# EAGLE design M360 (EAGLE 6.6.0)
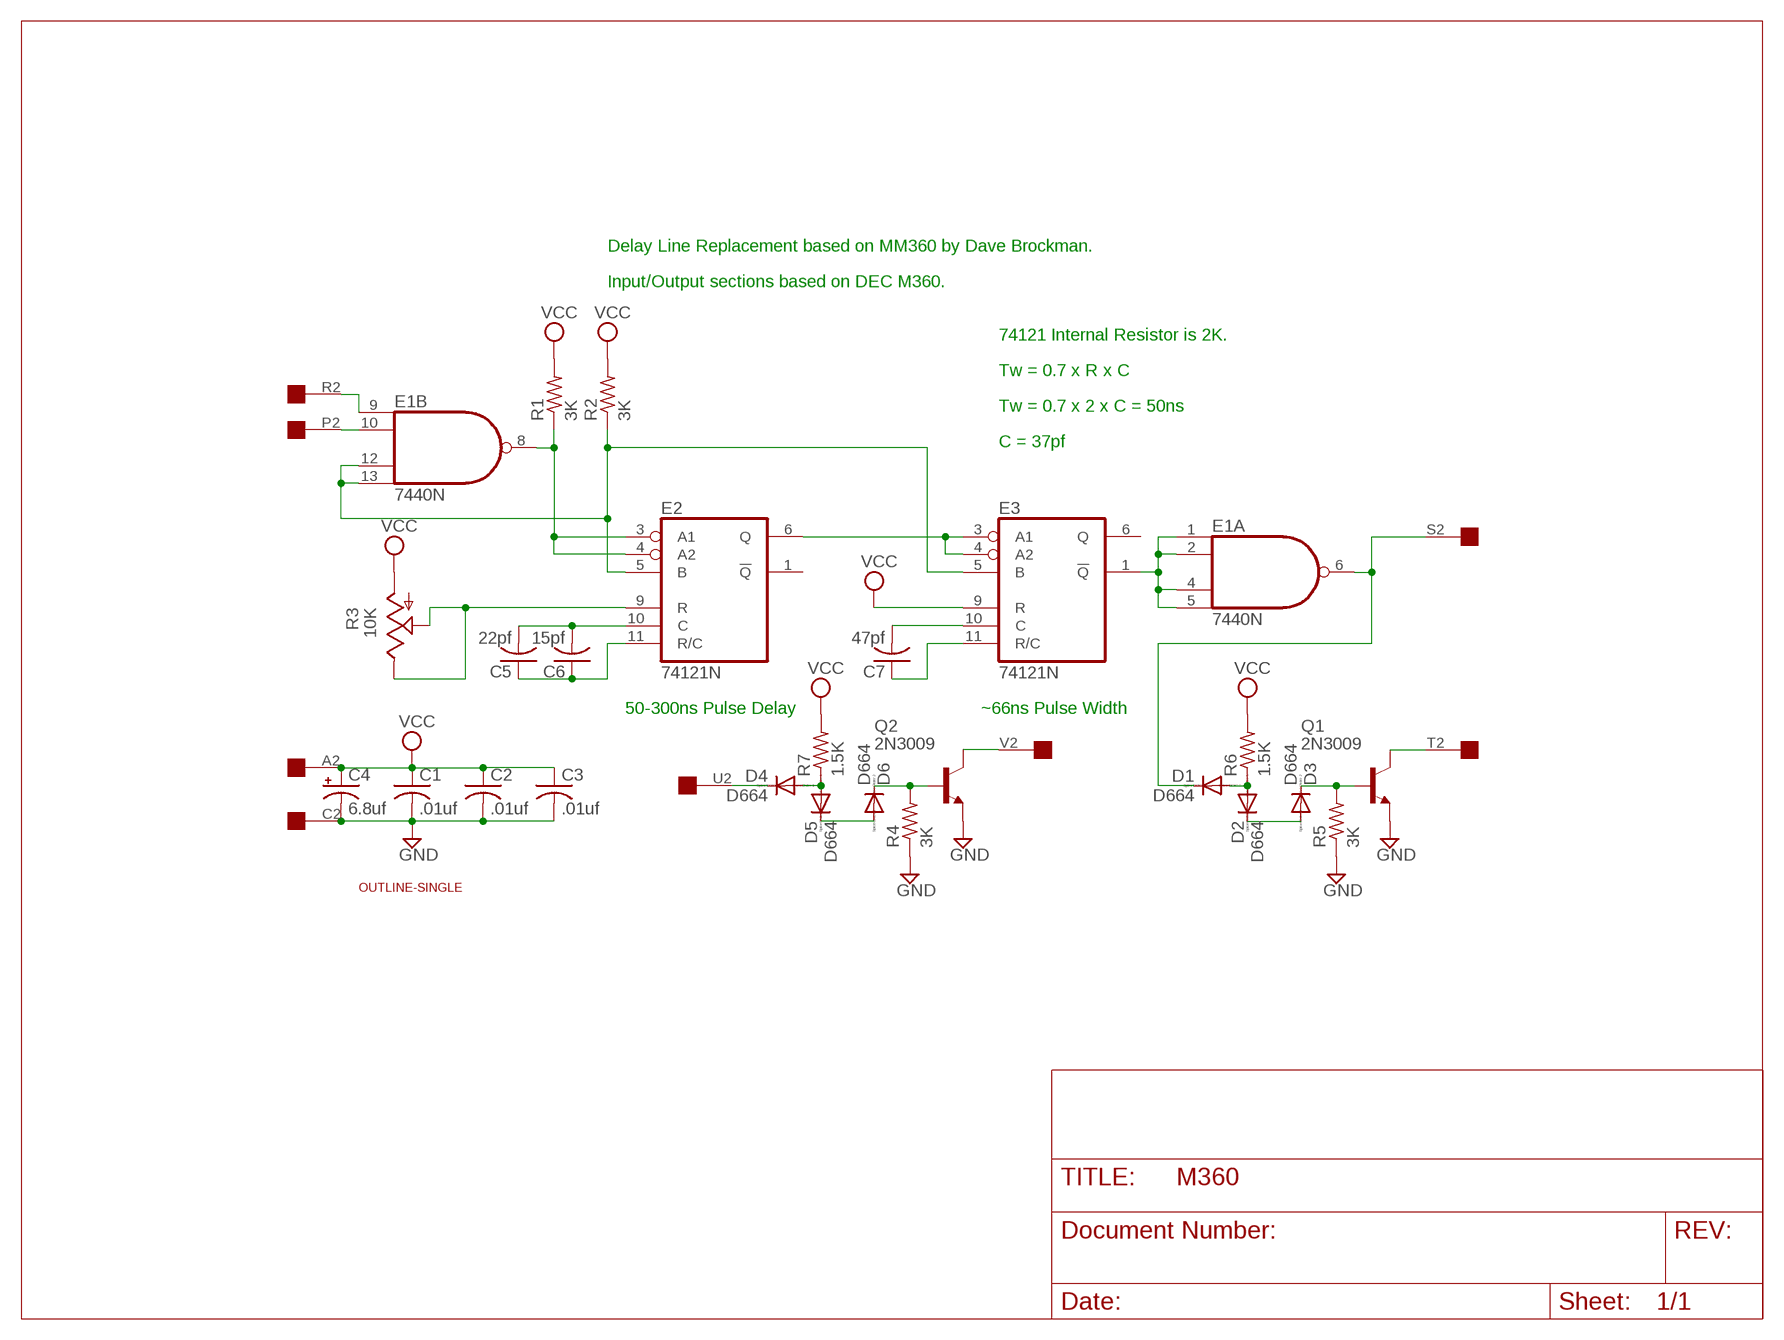
[diagram p0: schematic, sheet 1]

## Parts
C1  .01uf  C-US050-025X075  [C050-025X075]
C2  .01uf  C-US050-025X075  [C050-025X075]
C3  .01uf  C-US050-025X075  [C050-025X075]
C4  6.8uf  CPOL-USE15-5AXIAL  [E15-5]
C5  22pf  C-US050-025X075  [C050-025X075]
C6  15pf  C-US050-025X075  [C050-025X075]
C7  47pf  C-US050-025X075  [C050-025X075]
D1  D664  1N4148DO35-10  [DO35-10]
D2  D664  1N4148DO35-10  [DO35-10]
D3  D664  1N4148DO35-10  [DO35-10]
D4  D664  1N4148DO35-10  [DO35-10]
D5  D664  1N4148DO35-10  [DO35-10]
D6  D664  1N4148DO35-10  [DO35-10]
E1  7440N  74S40N  [DIL14]
E2  74121N  [DIL14]
E3  74121N  [DIL14]
Q1  2N3009  2N2405  [TO5]
Q2  2N3009  2N2405  [TO5]
R1  3K  R-US_0207/10  [0207/10]
R2  3K  R-US_0207/10  [0207/10]
R3  10K  TRIM_US-PTSPIN  [PT-SPIN]
R4  3K  R-US_0207/10  [0207/10]
R5  3K  R-US_0207/10  [0207/10]
R6  1.5K  R-US_0207/10  [0207/10]
R7  1.5K  R-US_0207/10  [0207/10]
U$1  OUTLINE-SINGLE  [SINGLE]
U$3  EDGE-1  [EDGE-CON1]

## Nets
GND [supply]: C1.2 C2.2 C3.2 C4.- Q1.1(E) Q2.1(E) R4.1 R5.1 U$3.C2
N$1: E2.6(Q) E3.3(A1) E3.4(A2)
N$2: E1.8(B:O) E2.3(A1) E2.4(A2) R1.1
N$3: E1.12(B:I2) E1.13(B:I3) E2.5(B) E3.5(B) R2.1
N$4: E1.1(A:I0) E1.2(A:I1) E1.4(A:I2) E1.5(A:I3) E3.1(!Q)
N$5: E1.10(B:I1) U$3.P2
N$6: E1.9(B:I0) U$3.R2
N$7: C5.2 C6.2 E2.10(C)
N$8: C7.2 E3.10(C)
N$9: C5.1 C6.1 E2.11(R/C)
N$10: E2.9(R) R3.E R3.S
N$11: D1.C E1.6(A:O) U$3.S2
N$12: Q2.3(C) U$3.V2
N$13: Q1.3(C) U$3.T2
N$14: D4.C U$3.U2
N$15: D6.C Q2.2(B) R4.2
N$16: C7.1 E3.11(R/C)
N$17: D5.C D6.A
N$18: D4.A D5.A R7.1
N$19: D1.A D2.A R6.1
N$20: D2.C D3.A
N$21: D3.C Q1.2(B) R5.2
VCC [supply]: C1.1 C2.1 C3.1 C4.+ E3.9(R) R1.2 R2.2 R3.A R6.2 R7.2 U$3.A2
Unconnected: E1.3(3:NC) E1.11(11:NC) E2.1(!Q) E3.6(Q) U$3.B2 U$3.D2 U$3.E2 U$3.F2 U$3.H2 U$3.J2 U$3.K2 U$3.L2 U$3.M2 U$3.N2

## Notes on the sheet
- Delay Line Replacement based on MM360 by Dave Brockman.
- Input/Output sections based on DEC M360.
- 74121 Internal Resistor is 2K.
- Tw = 0.7 x R x C
- Tw = 0.7 x 2 x C = 50ns
- C = 37pf
- 50-300ns Pulse Delay | ~66ns Pulse Width

## Power pins joined to a net without a drawn wire
GND: E1.7(P:GND) E2.7(GND) E3.7(GND)
VCC: E1.14(P:VCC) E2.14(VCC) E3.14(VCC)

## Library data of the parts
C1-C3 C5-C7 = rcl:C-US: CAPACITOR, American symbol
C4 = rcl:CPOL-US: POLARIZED CAPACITOR, American symbol
D1-D6 = diode:1N4148: DIODE high speed (Philips)
E1 = dec-con:74*40: Dual 4-input NAND gate
E2 E3 = 74xx-us:74*121: Monostable MULTIVIBRATOR, schmitt trigger inputs
Q1 Q2 = transistor:2N2405: NPN TRANSISTOR
R1 R2 R4-R7 = rcl:R-US_: RESISTOR, American symbol
R3 = pot:TRIM_US-: POTENTIOMETER
U$1 = dec-con:OUTLINE-*: Board outlines for DEC boards.
U$3 = dec-con:EDGE-1: Single-Sided DEC Edge Connector -- (side 2)

## Net classes
1 supply: width 0.762 mm, clearance 0.508 mm

## Board
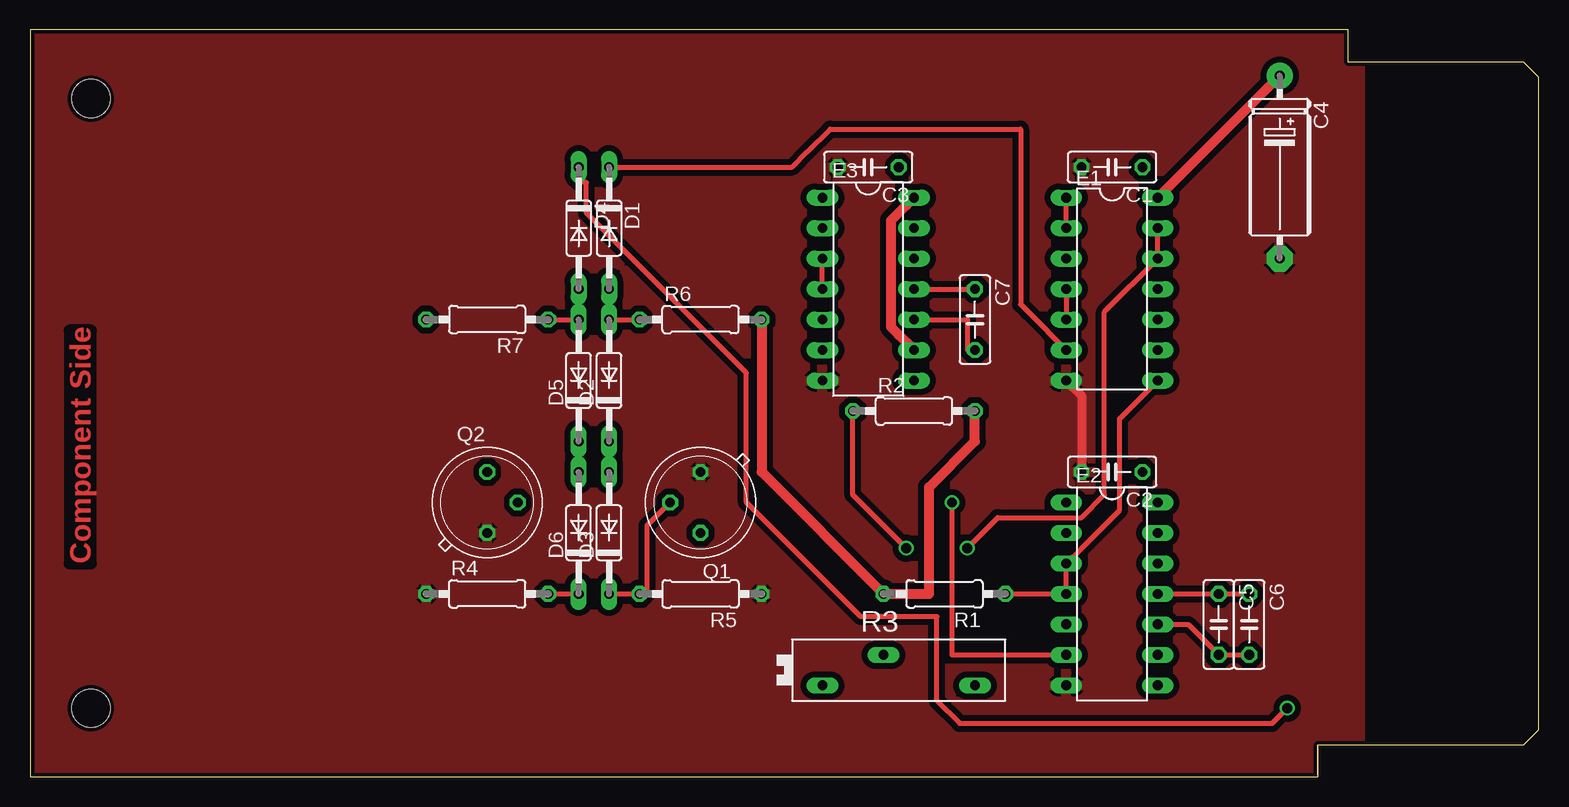
[diagram p1: board, top side]
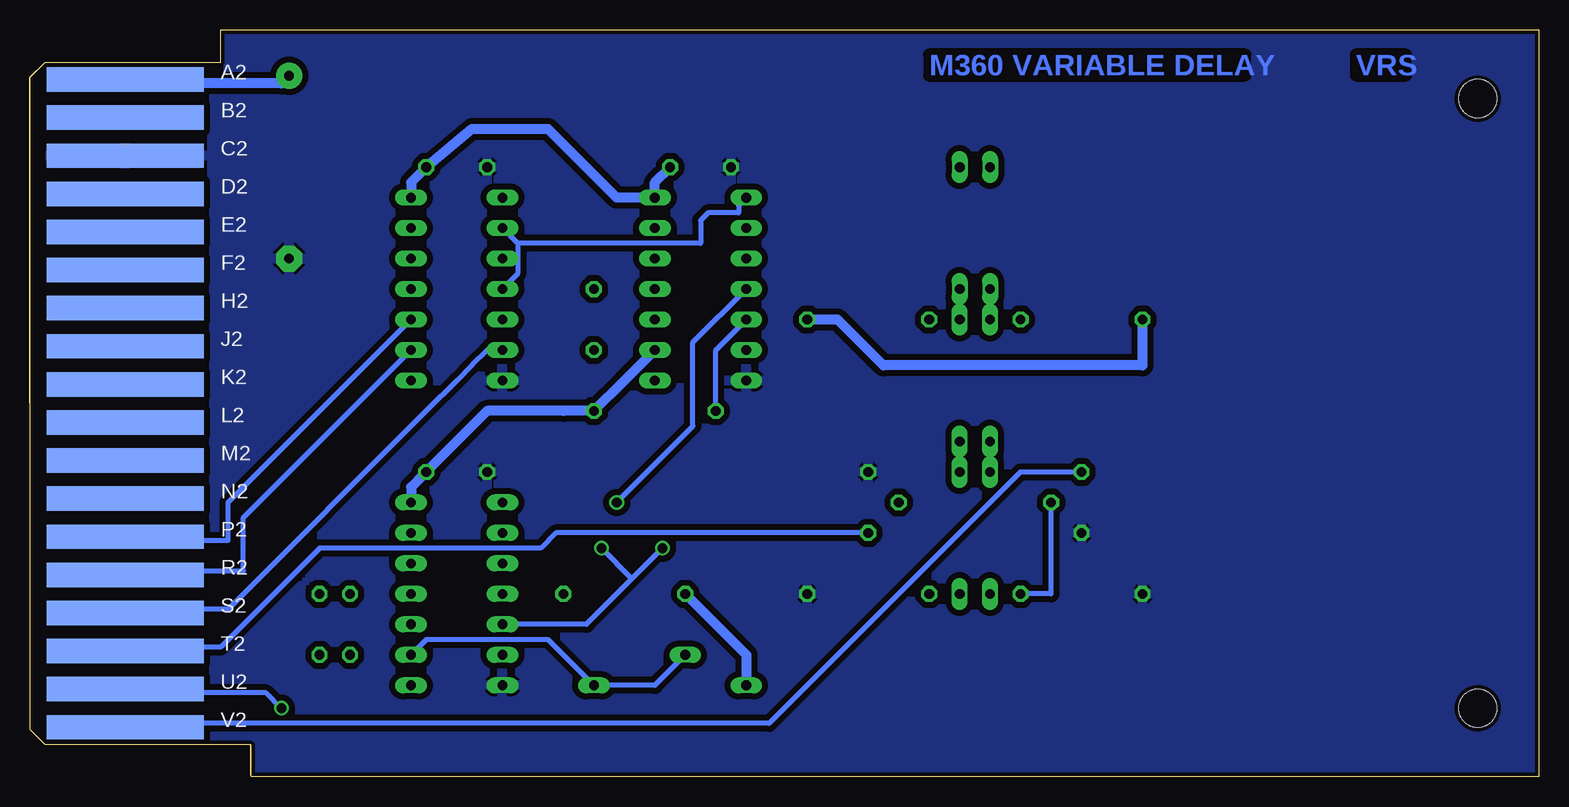
[diagram p2: board, bottom side, seen from below]

Size 125.73 x 62.23 mm. Coordinates in mm from the lower left corner, seen from the top.
Copper layers (1+16): Top 0.035mm / dielectric 1.5mm / Bottom 0.035mm
Design rules "16mils": minimum track width 16mil, minimum drill 32mil, track to track 15mil, track to pad 10mil, pad to pad 10mil, via to via 10mil, smd to smd 10mil, copper to edge 13mil, drill to drill 10mil, minimum pad ring 10mil, minimum via ring 8mil, stop-mask expansion 0mil, vias tented up to drill 0mil, thermal gap 10mil

### Footprints (pad centres in the part's own frame; a part is rotated, then mirrored left to right if it is on the bottom)
C050-025X075 = drill 0.813 octagon: 1 -2.54,0; 2 2.54,0
E15-5 = drill 0.813 pad 2.159: + -7.62,0 | drill 0.813 pad 2.159 octagon: - 7.62,0
DO35-10 = drill 0.813 long: A 5.08,0; C -5.08,0
DIL14 = drill 0.813 long: 1 -7.62,-3.81; 2 -5.08,-3.81; 3 -2.54,-3.81; 4 0,-3.81; 5 2.54,-3.81; 6 5.08,-3.81; 7 7.62,-3.81; 8 7.62,3.81; 9 5.08,3.81; 10 2.54,3.81; 11 0,3.81; 12 -2.54,3.81; 13 -5.08,3.81; 14 -7.62,3.81
TO5 = drill 0.813 octagon: 1 0,-2.54; 2 2.54,0; 3 0,2.54
0207/10 = drill 0.813 octagon: 1 -5.08,0; 2 5.08,0
PT-SPIN = drill 0.813 long: A -6.35,-1.27; E 6.35,-1.27; S -1.27,1.27
SINGLE = hole 3.175: 120.65,56.515; 120.65,5.715
EDGE-CON1 = smd 13.106 x 2.032 bottom: A2 7.938,4.128; B2 7.938,7.303; C2 7.938,10.477; D2 7.938,13.652; E2 7.938,16.828; F2 7.938,20.003; H2 7.938,23.177; J2 7.938,26.352; K2 7.938,29.527; L2 7.938,32.703; M2 7.938,35.877; N2 7.938,39.053; P2 7.938,42.227; R2 7.938,45.403; S2 7.938,48.578; T2 7.938,51.752; U2 7.938,54.928; V2 7.938,58.102

### Placement (x,y rotation side)
C1  90.17,50.8 180 top
C2  90.17,25.4 180 top
C3  69.85,50.8 180 top
C4  104.14,50.8 270 top
C5  99.06,12.7 270 top
C6  101.6,12.7 270 top
C7  78.74,38.1 270 top
D1  48.26,45.72 270 top
D2  48.26,33.02 90 top
D3  48.26,20.32 90 top
D4  45.72,45.72 270 top
D5  45.72,33.02 90 top
D6  45.72,20.32 90 top
E1  90.17,40.64 270 top
E2  90.17,15.24 270 top
E3  69.85,40.64 270 top
Q1  55.88,22.86 180 top
Q2  38.1,22.86 0 top
R1  76.2,15.24 180 top
R2  73.66,30.48 0 top
R3  72.39,8.89 0 top
R4  38.1,15.24 0 top
R5  55.88,15.24 180 top
R6  55.88,38.1 0 top
R7  38.1,38.1 180 top
U$1  125.73,62.23 180 top
U$3  125.73,62.23 180 top

### Tracks (layer width: path | path; a pad name or v marks a point on that pad's centre or on a via)
GND
  Top 0.762: E1.7 87.63,31.75 C2.2
  pour Bottom: 0,0 125.73,0 125.73,62.23 0,62.23
  pour Top: 0,0 125.73,0 125.73,62.23 0,62.23
N$1  (via drill 0.81)
  Top 0.406: E3.4 E3.3 | v76.83,22.86 76.83,10.16 E2.6
  Bottom 0.406: v76.83,22.86 70.48,29.21 70.48,36.2 E3.4
N$2
  Top 0.406: R1.1 E2.4 E2.3 87.63,19.05 90.81,22.23 90.81,29.84 E1.8
N$3  (via drill 0.81)
  Top 0.406: E1.13 E1.12 89.53,38.73 89.53,23.5 87.63,21.59 80.64,21.59 v78.11,19.05 | v73.03,19.05 68.58,23.5 R2.1
  Bottom 0.406: R2.1 68.58,35.56 66.67,37.47 E3.5 | v73.03,19.05 75.56,16.51 | 75.56,16.51 79.38,12.7 E2.5 | 75.56,16.51 v78.11,19.05
N$4
  Top 0.406: E1.4 E1.5 | E1.2 E1.1
  Bottom 0.406: 85.09,44.45 69.85,44.45 69.85,46.35 69.22,46.99 66.67,46.99 66.67,47.62 E3.1 | 85.09,44.45 85.72,45.09 E1.2 | 85.09,44.45 85.09,41.91 E1.4
N$5
  Bottom 0.406: E1.10 94.61,37.47 95.25,36.83 109.22,22.86 109.22,19.68 111.76,19.68 U$3.P2
N$6
  Bottom 0.406: E1.9 94.61,34.92 95.25,34.29 107.95,21.59 107.95,17.14 111.76,17.14 U$3.R2
N$7
  Top 0.406: E2.10 96.52,12.7 C5.2 C6.2
N$8
  Top 0.406: E3.10 78.11,38.1 78.11,35.56 C7.2
N$9
  Top 0.406: E2.11 C5.1 C6.1
N$10
  Bottom 0.406: E2.9 92.71,11.43 82.55,11.43 R3.E 73.66,7.62 R3.S
N$11
  Top 0.406: D1.C 63.5,50.8 64.77,52.07 66.67,53.98 82.55,53.98 82.55,39.37 83.19,38.73 E1.6
  Bottom 0.406: E1.6 87.63,35.56 88.9,34.29 90.17,33.02 92.71,30.48 109.22,13.97 111.76,13.97 U$3.S2
N$12
  Bottom 0.406: Q2.3 43.18,25.4 64.14,4.45 111.76,4.45 U$3.V2
N$13
  Bottom 0.406: Q1.3 81.92,20.32 83.19,19.05 101.6,19.05 109.86,10.79 111.76,10.79 U$3.T2
N$14  (via drill 0.81)
  Top 0.406: v104.78,5.71 103.5,4.45 77.47,4.45 75.56,6.35 75.56,13.34 69.22,13.34 59.69,22.86 59.69,33.66 46.35,46.99 46.35,49.53 45.72,49.53 D4.C
  Bottom 0.406: v104.78,5.71 106.05,6.99 111.76,6.99 U$3.U2
N$15
  Top 0.406: R4.2 D6.C
  Bottom 0.406: R4.2 40.64,15.24 Q2.2
N$16
  Top 0.406: E3.11 C7.1
N$17
  Top 0.406: D6.A D5.C
N$18
  Top 0.406: R7.1 D5.A D4.A
N$19
  Top 0.406: D1.A D2.A R6.1
N$20
  Top 0.406: D3.A D2.C
N$21
  Top 0.406: D3.C R5.2 51.44,15.24 51.44,20.95 Q1.2
VCC
  Top 0.813: E1.14 100.97,55.24 103.5,57.78 C4.+ | E3.14 73.03,47.62 72.39,46.99 71.75,46.35 71.75,37.47 72.39,36.83 73.03,36.2 E3.9 | R2.2 78.74,27.94 74.93,24.13 74.93,15.24 R1.2 60.96,25.4 R6.2
  Bottom 0.813: E1.14 93.98,49.53 93.34,50.16 C1.1 88.9,53.98 82.55,53.98 76.83,48.26 E3.14 73.66,49.53 C3.1 | C4.+ 104.78,57.78 111.76,57.78 U$3.A2 | R7.2 33.02,34.29 54.61,34.29 58.42,38.1 R6.2 | R1.2 69.22,13.34 66.04,10.16 66.04,8.26 R3.A | E2.14 93.98,24.13 93.34,24.77 C2.1 87.63,30.48 81.28,30.48 R2.2 76.2,33.02 74.3,34.92 E3.9

### Text on the board
Top: Component Side
Bottom: VRS | M360 VARIABLE DELAY